# Altium schematic sheet Solution_1.SchDoc
size A4
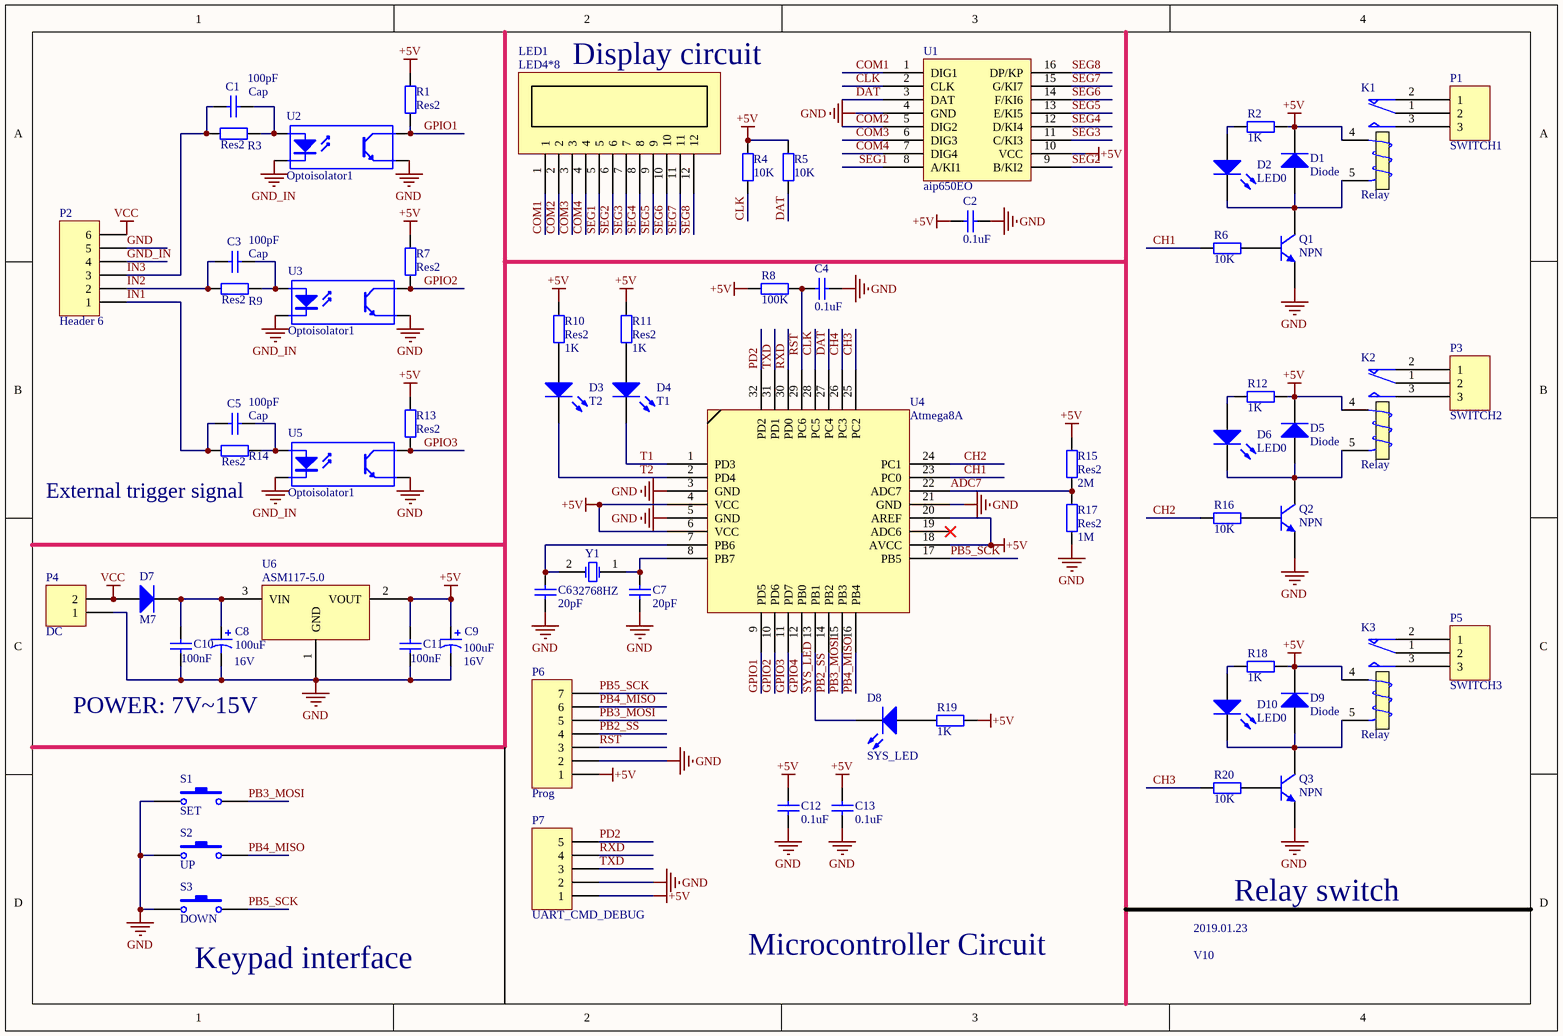
[diagram p0: Solution_1.SchDoc]

## Parts
C1  Cap  value 100pF  [RAD-0.3]
C2  0.1uF  [RAD-0.3]
C3  Cap  value 100pF  [RAD-0.3]
C4  0.1uF  [RAD-0.3]
C5  Cap  value 100pF  [RAD-0.3]
C6  20pF  [RAD-0.3]
C7  20pF  [RAD-0.3]
C8  100uF  value 16V  [C0805]
C9  100uF  value 16V  [C0805]
C10  100nF  [RAD-0.3]
C11  100nF  [RAD-0.3]
C12  0.1uF  [RAD-0.3]
C13  0.1uF  [RAD-0.3]
D1  Diode  [SMC]
D2  LED0  [LED-0]
D3  T2  [LED-0]
D4  T1  [LED-0]
D5  Diode  [SMC]
D6  LED0  [LED-0]
D7  M7  [SMC]
D8  SYS_LED  [LED-0]
D9  Diode  [SMC]
D10  LED0  [LED-0]
K1  Relay  [MODULE5B]
K2  Relay  [MODULE5B]
K3  Relay  [MODULE5B]
LED1  LED4*8
P1  SWITCH1  [HDR1X3]
P2  Header 6  [HDR1X6]
P3  SWITCH2  [HDR1X3]
P4  DC  [HDR1X2]
P5  SWITCH3  [HDR1X3]
P6  Prog  [HDR1X7]
P7  UART_CMD_DEBUG  [HDR1X5]
Q1  NPN  [TO-226-AA]
Q2  NPN  [TO-226-AA]
Q3  NPN  [TO-226-AA]
R1  Res2  [AXIAL-0.4]
R2  1K  [AXIAL-0.4]
R3  Res2  [AXIAL-0.4]
R4  10K  [AXIAL-0.4]
R5  10K  [AXIAL-0.4]
R6  10K  [AXIAL-0.4]
R7  Res2  [AXIAL-0.4]
R8  100K  [AXIAL-0.4]
R9  Res2  [AXIAL-0.4]
R10  Res2  value 1K  [AXIAL-0.4]
R11  Res2  value 1K  [AXIAL-0.4]
R12  1K  [AXIAL-0.4]
R13  Res2  [AXIAL-0.4]
R14  Res2  [AXIAL-0.4]
R15  Res2  value 2M  [AXIAL-0.4]
R16  10K  [AXIAL-0.4]
R17  Res2  value 1M  [AXIAL-0.4]
R18  1K  [AXIAL-0.4]
R19  1K  [AXIAL-0.4]
R20  10K  [AXIAL-0.4]
S1  SET  [SPST-2]
S2  UP  [SPST-2]
S3  DOWN  [SPST-2]
U1  aip650EO
U2  Optoisolator1  [DIP-4]
U3  Optoisolator1  [DIP-4]
U4  Atmega8A
U5  Optoisolator1  [DIP-4]
U6  ASM117-5.0
Y1  32768HZ  [R38]

## Nets
+5V: C2.2 C9.1 C11.2 C12.2 C13.2 D1.2(K) D5.2(K) D9.2(K) K1.4(T1) K2.4(T1) K3.4(T1) P6.1 P7.1 R1.2 R2.2 R4.2 R5.2 R7.2 R8.1 R10.2 R11.2 R12.2 R13.2 R15.2 R18.2 R19.2 U1.10(VCC) U4.4(VCC) U4.6(VCC) U4.18(AVCC) U4.20(AREF) U6.2(VOUT)
GND: C2.1 C4.1 C6.1 C7.1 C8.2 C9.2 C10.1 C11.1 C12.1 C13.1 P2.5 P4.1 P6.2 P7.2 Q1.3(E) Q2.3(E) Q3.3(E) R17.1 S1.1 S2.1 S3.1 U1.4(GND) U2.3(E) U3.3(E) U4.3(GND) U4.5(GND) U4.21(GND) U5.3(E) U6.1(GND)
GND_IN: P2.4 U2.2(K) U3.2(K) U5.2(K)
VCC: D7.1(A) P2.6 P4.2
ADC7: R15.1 R17.2 U4.22(ADC7)
CH1: R6.1 U4.23(PC0)
CH2: R16.1 U4.24(PC1)
CH3: R20.1 U4.25(PC2)
CH4: U4.26(PC3)
CLK: R4.1 U1.2(CLK) U4.28(PC5)
COM1: LED1.1 U1.1(DIG1)
COM2: LED1.2 U1.5(DIG2)
COM3: LED1.3 U1.6(DIG3)
COM4: LED1.4 U1.7(DIG4)
DAT: R5.1 U1.3(DAT) U4.27(PC4)
GPIO1: R1.1 U2.4(C) U4.9(PD5)
GPIO2: R7.1 U3.4(C) U4.10(PD6)
GPIO3: R13.1 U4.11(PD7) U5.4(C)
GPIO4: U4.12(PB0)
IN1: C5.1 P2.1 R14.1
IN2: C3.1 P2.2 R9.1
IN3: C1.1 P2.3 R3.1
PB2_SS: P6.4 U4.14(PB2)
PB3_MOSI: P6.5 S1.2 U4.15(PB3)
PB4_MISO: P6.6 S2.2 U4.16(PB4)
PB5_SCK: P6.7 S3.2 U4.17(PB5)
PD2: P7.5 U4.32(PD2)
RST: C4.2 P6.3 R8.2 U4.29(PC6)
RXD: P7.4 U4.30(PD0)
SEG1: LED1.5 U1.8(A/KI1)
SEG2: LED1.6 U1.9(B/KI2)
SEG3: LED1.7 U1.11(C/KI3)
SEG4: LED1.8 U1.12(D/KI4)
SEG5: LED1.9 U1.13(E/KI5)
SEG6: LED1.10 U1.14(F/KI6)
SEG7: LED1.11 U1.15(G/KI7)
SEG8: LED1.12 U1.16(DP/KP)
SYS_LED: D8.2(K) U4.13(PB1)
T1: D4.2(K) U4.1(PD3)
T2: D3.2(K) U4.2(PD4)
TXD: P7.3 U4.31(PD1)
NetC1_2: C1.2 R3.2 U2.1(A)
NetC3_2: C3.2 R9.2 U3.1(A)
NetC5_2: C5.2 R14.2 U5.1(A)
NetC6_2: C6.2 U4.7(PB6) Y1.2(OSC2)
NetC7_2: C7.2 U4.8(PB7) Y1.1(OSC1)
NetC8_1: C8.1 C10.2 D7.2(K) U6.3(VIN)
NetD1_1: D1.1(A) D2.2(K) K1.5(T2) Q1.1(C)
NetD2_1: D2.1(A) R2.1
NetD3_1: D3.1(A) R10.1
NetD4_1: D4.1(A) R11.1
NetD5_1: D5.1(A) D6.2(K) K2.5(T2) Q2.1(C)
NetD6_1: D6.1(A) R12.1
NetD8_1: D8.1(A) R19.1
NetD9_1: D9.1(A) D10.2(K) K3.5(T2) Q3.1(C)
NetD10_1: D10.1(A) R18.1
NetK1_1: K1.1(COM) P1.2
NetK1_2: K1.2(NC) P1.1
NetK1_3: K1.3(NO) P1.3
NetK2_1: K2.1(COM) P3.2
NetK2_2: K2.2(NC) P3.1
NetK2_3: K2.3(NO) P3.3
NetK3_1: K3.1(COM) P5.2
NetK3_2: K3.2(NC) P5.1
NetK3_3: K3.3(NO) P5.3
NetQ1_2: Q1.2(B) R6.2
NetQ2_2: Q2.2(B) R16.2
NetQ3_2: Q3.2(B) R20.2

Not connected (* = marked no-connect by the designer): U4 19(ADC6)*

## Notes on the sheet
- Display circuit
- (near U5) External trigger signal
- POWER: 7V~15V
- Relay switch
- (near S3) Keypad interface
- Microcontroller Circuit
- 2019.01.23
- V10

## Library data of the parts
C1 C3 C5 C10 C11 = Cap: Capacitor; Published: 8-Jun-2000; LatestRevisionDate: 17-Jul-2002; LatestRevisionNote: Re-released for DXP Platform.; PackageReference: RAD-0.3; Publisher: Altium Limited; PackageDescription: Radial Cap, Thru-Hole; 2 Leads; 0.3 in Pin Spacing
  C10 C11: Value: 100nF
C2 C4 C6 C7 C12 C13 = Cap: Capacitor; Value: 100pF; Published: 8-Jun-2000; LatestRevisionDate: 17-Jul-2002; LatestRevisionNote: Re-released for DXP Platform.; PackageReference: RAD-0.3; Publisher: Altium Limited; PackageDescription: Radial Cap, Thru-Hole; 2 Leads; 0.3 in Pin Spacing
C8 C9 = Cap Pol3: Polarized Capacitor (Surface Mount); Published: 8-Jun-2000; LatestRevisionDate: 29-May-2009; LatestRevisionNote: IPC-7351 Footprint Added.; PackageReference: C0805; Publisher: Altium Limited; PackageDescription: Chip Capacitor
D1 D5 D7 D9 = Diode: Default Diode; Published: 8-Jun-2000; LatestRevisionDate: 17-Jul-2002; LatestRevisionNote: Re-released for DXP Platform.; PackageVersion: Sep-1996; PackageReference: SMC; Publisher: Altium Limited; PackageDescription: DO-214-AB/SMC; 2 C-Bend Leads; Body 7.9 x 5.9 mm, inc. leads (LxW); Code_JEDEC: DO-214-AB
D2-D4 D6 D8 D10 = LED0: Typical INFRARED GaAs LED; Published: 8-Jun-2000; LatestRevisionDate: 08-Jul-2005; LatestRevisionNote: Mech Layer 1 removed.; PackageReference: LED-0; Publisher: Altium Limited; PackageDescription: LED; 2 Leads
K1-K3 = Relay: SPDT Relay; Published: 8-Jun-2000; LatestRevisionDate: 17-Jul-2002; LatestRevisionNote: Re-released for DXP Platform.; PackageReference: MODULE5B; Publisher: Altium Limited
LED1 = LED Displayer: 4 digital LED Displayer
P1 P3 P5 = Header 3: Header, 3-Pin; LatestRevisionDate: 17-Jul-2002; LatestRevisionNote: Re-released for DXP Platform.; Publisher: Altium Limited
P2 = Header 6: Header, 6-Pin; LatestRevisionDate: 17-Jul-2002; LatestRevisionNote: Re-released for DXP Platform.; Publisher: Altium Limited
P4 = Header 2: Header, 2-Pin; LatestRevisionDate: 17-Jul-2002; LatestRevisionNote: Re-released for DXP Platform.; Publisher: Altium Limited
P6 = Header 7: Header, 7-Pin; LatestRevisionDate: 17-Jul-2002; LatestRevisionNote: Re-released for DXP Platform.; Publisher: Altium Limited
P7 = Header 5: Header, 5-Pin; LatestRevisionDate: 17-Jul-2002; LatestRevisionNote: Re-released for DXP Platform.; Publisher: Altium Limited
Q1-Q3 = NPN: NPN Bipolar Transistor; Published: 8-Jun-2000; LatestRevisionDate: 17-Jul-2002; LatestRevisionNote: Re-released for DXP Platform.; PackageReference: TO-226-AA; Publisher: Altium Limited; PackageDescription: TO, Flat Index; 3 In-Line, Axial Leads; Body Dia. 4.8mm; Leads 0.55 x 0.51 mm (max); Code_JEDEC: TO-226-AA
R1-R3 R7 R9-R15 R17-R19 = Res2: Resistor; Published: 8-Jun-2000; LatestRevisionDate: 17-Jul-2002; LatestRevisionNote: Re-released for DXP Platform.; PackageReference: AXIAL-0.4; Publisher: Altium Limited; PackageDescription: Axial Device, Thru-Hole; 2 Leads; 0.4 in Pin Spacing
  R2 R12 R18 R19: Value: 1K
R4-R6 R8 R16 R20 = Res2: Resistor; Value: 1K; Published: 8-Jun-2000; LatestRevisionDate: 17-Jul-2002; LatestRevisionNote: Re-released for DXP Platform.; PackageReference: AXIAL-0.4; Publisher: Altium Limited; PackageDescription: Axial Device, Thru-Hole; 2 Leads; 0.4 in Pin Spacing
S1-S3 = SW-PB: Switch; Published: 24-Mar-1999; LatestRevisionDate: 17-Jul-2002; LatestRevisionNote: Re-released for DXP Platform.; PackageReference: SPST-2; Publisher: Altium Limited; PackageDescription: Switch; 2 Leads
U1 = aip650Eo: LED driver
U2 U3 U5 = Optoisolator1: 4-Pin Phototransistor Optocoupler; Published: 24-Mar-1999; LatestRevisionDate: 04-Mar-2005; LatestRevisionNote: Sch pins 3 & 4 Swapped.; DatasheetVersion: Nov-2003; PackageReference: DIP-4; Publisher: Altium Limited
U4 = ATMEGA8A: AVR 8bit microcontroller
U6 = ASM117-5.0: 5V 1A LOW DROPOUT VOLTAGE REGULATOR
Y1 = XTAL: Crystal Oscillator; Published: 8-Jun-2000; LatestRevisionDate: 17-Jul-2002; LatestRevisionNote: Re-released for DXP Platform.; PackageReference: R38; Publisher: Altium Limited; PackageDescription: Crystal, Thru-Hole; 2 Leads; Body 3.1 x 8.2 mm (Dia.xH)